# EAGLE design 510_health_arduino (EAGLE 9.6.2)
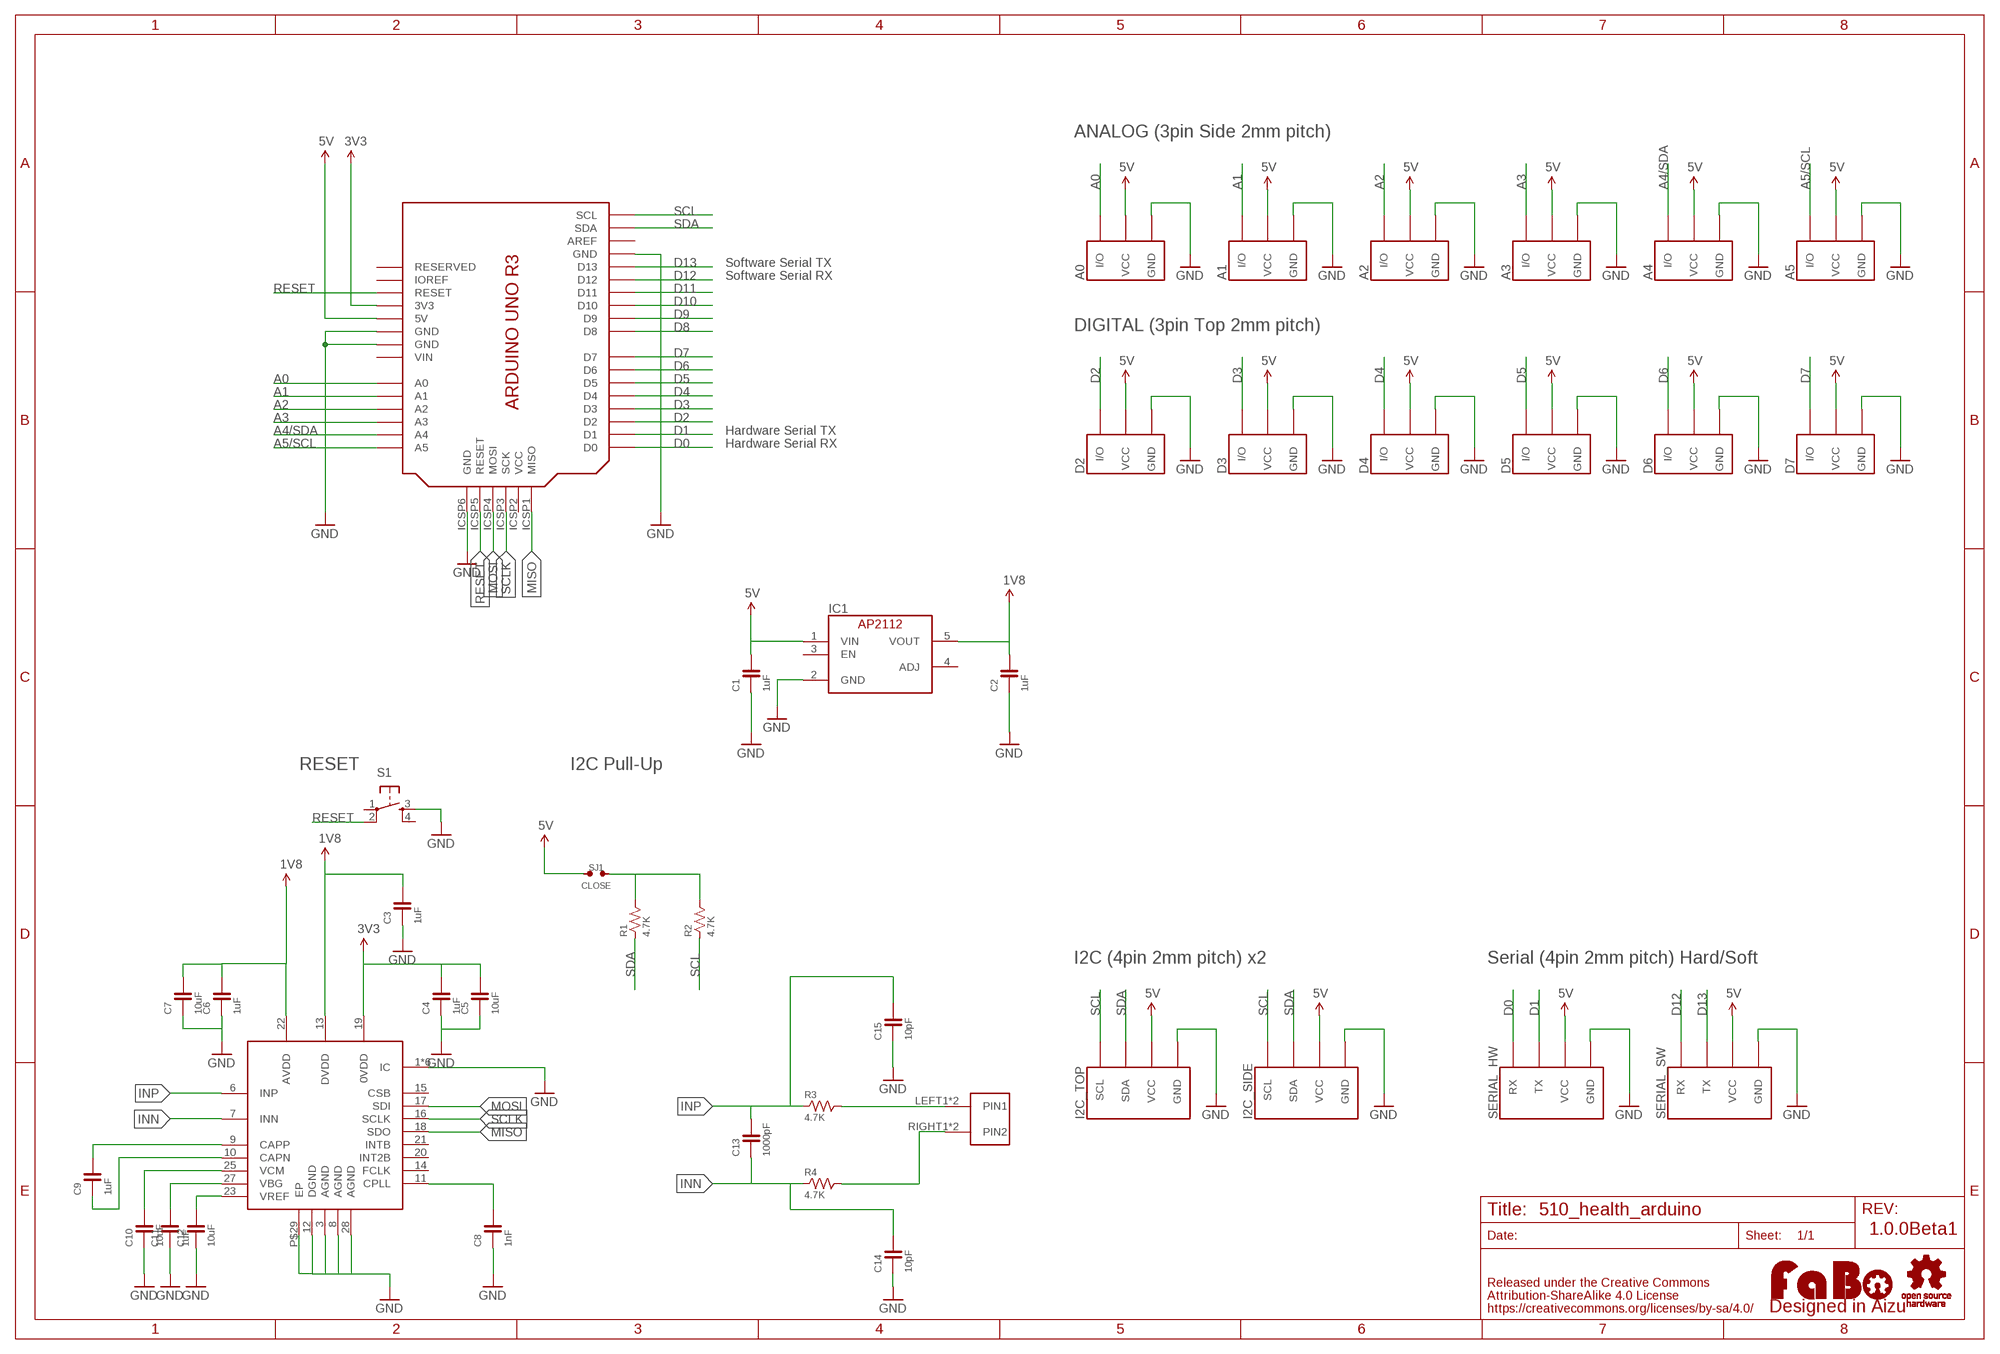
[diagram p0: schematic, sheet 1]

## Parts
A0  FABO_BRICK_3PIN-S03B-PASK-2_LONG  [FABO_BRICK_3PIN_S03B-PASK-2_LONG]
A1  FABO_BRICK_3PIN-S03B-PASK-2_LONG  [FABO_BRICK_3PIN_S03B-PASK-2_LONG]
A2  FABO_BRICK_3PIN-S03B-PASK-2_LONG  [FABO_BRICK_3PIN_S03B-PASK-2_LONG]
A3  FABO_BRICK_3PIN-S03B-PASK-2_LONG  [FABO_BRICK_3PIN_S03B-PASK-2_LONG]
A4  FABO_BRICK_3PIN-S03B-PASK-2_LONG  [FABO_BRICK_3PIN_S03B-PASK-2_LONG]
A5  FABO_BRICK_3PIN-S03B-PASK-2_LONG  [FABO_BRICK_3PIN_S03B-PASK-2_LONG]
C1  1uF  CAPACITOR-0603  [0603]
C2  1uF  CAPACITOR-0603  [0603]
C3  1uF  CAPACITOR-0603  [0603]
C4  1uF  CAPACITOR-0603  [0603]
C5  10uF  CAPACITOR-0603  [0603]
C6  1uF  CAPACITOR-0603  [0603]
C7  10uF  CAPACITOR-0603  [0603]
C8  1nF  CAPACITOR-0603  [0603]
C9  1uF  CAPACITOR-0603  [0603]
C10  10uF  CAPACITOR-0603  [0603]
C11  1uF  CAPACITOR-0603  [0603]
C12  10uF  CAPACITOR-0603  [0603]
C13  1000pF  CAPACITOR-0603  [0603]
C14  10pF  CAPACITOR-0603  [0603]
C15  10pF  CAPACITOR-0603  [0603]
D2  FABO_BRICK_3PIN-B03B-PASK-1  [FABO_BRICK_3PIN_B03B-PASK-1]
D3  FABO_BRICK_3PIN-B03B-PASK-1  [FABO_BRICK_3PIN_B03B-PASK-1]
D4  FABO_BRICK_3PIN-B03B-PASK-1  [FABO_BRICK_3PIN_B03B-PASK-1]
D5  FABO_BRICK_3PIN-B03B-PASK-1  [FABO_BRICK_3PIN_B03B-PASK-1]
D6  FABO_BRICK_3PIN-B03B-PASK-1  [FABO_BRICK_3PIN_B03B-PASK-1]
D7  FABO_BRICK_3PIN-B03B-PASK-1  [FABO_BRICK_3PIN_B03B-PASK-1]
E1  MA-MAX30003  [MAXIM-MAX30003]
I2C_SIDE  FABO_BRICK_I2C-S04B-PASK-2_LONG  [FABO_BRICK_I2C_S04B-PASK-2_LONG]
I2C_TOP  FABO_BRICK_I2C-B04B-PASK-1  [FABO_BRICK_I2C_B04B-PASK-1]
IC1  AP2112K-1.8TRG1  [SOT-23-5]
LOGO1  LOGO_FABO-M  [LOGO_FABO_M]
R1  4.7K  RESISTOR-0603  [0603]
R2  4.7K  RESISTOR-0603  [0603]
R3  4.7K  RESISTOR-0603  [0603]
R4  4.7K  RESISTOR-0603  [0603]
S1  TACT-SWITCH-6MM  [DTS_6_V]
SERIAL_HW  FABO_BRICK_SERIAL-B04B-PASK-1  [FABO_BRICK_SERIAL_B04B-PASK-1]
SERIAL_SW  FABO_BRICK_SERIAL-B04B-PASK-1  [FABO_BRICK_SERIAL_B04B-PASK-1]
SJ1  CLOSE  SMD-JUMPER-2-0603  [SMD-JUMPER-0603]
U$4  ML-1400-S1  [ML-1400-S1]
U$13  LOGO_OSHW-T_M_BOTTOM  [LOGO_OSHW_T_MS_BOTTOM]
U$15  ARDUINO_UNO_R3_SPI  [ARDUINO_UNO_R3_SPI]

## Nets
1V8: C2.2 C3.2 C6.2 C7.2 E1.13(DVDD) E1.22(AVDD) IC1.5(VOUT)
3V3: C4.2 C5.2 E1.19(0VDD) U$15.3V3
5V: A0.VCC A1.VCC A2.VCC A3.VCC A4.VCC A5.VCC C1.2 D2.VCC D3.VCC D4.VCC D5.VCC D6.VCC D7.VCC I2C_SIDE.VCC I2C_TOP.VCC IC1.1(VIN) SERIAL_HW.VCC SERIAL_SW.VCC SJ1.1 U$15.5V
A0: A0.I/O U$15.A0
A1: A1.I/O U$15.A1
A2: A2.I/O U$15.A2
A3: A3.I/O U$15.A3
A4/SDA: A4.I/O U$15.A4
A5/SCL: A5.I/O U$15.A5
D0: SERIAL_HW.RX U$15.D0
D1: SERIAL_HW.TX U$15.D1
D2: D2.I/O U$15.D2
D3: D3.I/O U$15.D3
D4: D4.I/O U$15.D4
D5: D5.I/O U$15.D5
D6: D6.I/O U$15.D6
D7: D7.I/O U$15.D7
D8: U$15.D8
D9: U$15.D9
D10: U$15.D10
D11: U$15.D11
D12: SERIAL_SW.RX U$15.D12
D13: SERIAL_SW.TX U$15.D13
GND: A0.GND A1.GND A2.GND A3.GND A4.GND A5.GND C1.1 C2.1 C3.1 C4.1 C5.1 C6.1 C7.1 C8.1 C10.1 C11.1 C12.1 C14.1 C15.1 D2.GND D3.GND D4.GND D5.GND D6.GND D7.GND E1.1(IC) E1.2(IC) E1.3(AGND) E1.4(IC) E1.5(IC) E1.8(AGND) E1.12(DGND) E1.24(IC) E1.26(IC) E1.28(AGND) E1.P$29(EP) I2C_SIDE.GND I2C_TOP.GND IC1.2(GND) S1.3 SERIAL_HW.GND SERIAL_SW.GND U$15.GND1(GND) U$15.GND2(GND) U$15.GND3(GND) U$15.ICSP6(GND)
INN: C13.1 C14.2 E1.7(INN) R4.1
INP: C13.2 C15.2 E1.6(INP) R3.1
MISO: E1.18(SDO) U$15.ICSP1(MISO)
MOSI: E1.17(SDI) U$15.ICSP4(MOSI)
N$1: R1.2 R2.2 SJ1.2
N$2: C9.2 E1.9(CAPP)
N$3: C9.1 E1.10(CAPN)
N$4: C8.2 E1.11(CPLL)
N$5: R3.2 U$4.LEFT1(PIN1) U$4.LEFT2(PIN1)
N$6: R4.2 U$4.RIGHT1(PIN2) U$4.RIGHT2(PIN2)
N$7: C10.2 E1.25(VCM)
N$8: C11.2 E1.27(VBG)
N$9: C12.2 E1.23(VREF)
RESET: S1.2 U$15.ICSP5(RESET) U$15.RESET
SCL: I2C_SIDE.SCL I2C_TOP.SCL R2.1 U$15.SCL
SCLK: E1.16(SCLK) U$15.ICSP3(SCK)
SDA: I2C_SIDE.SDA I2C_TOP.SDA R1.1 U$15.SDA
Unconnected: E1.14(FCLK) E1.15(CSB) E1.20(INT2B) E1.21(INTB) IC1.3(EN) IC1.4(ADJ) S1.1 S1.4 U$15.AREF U$15.ICSP2(VCC) U$15.IOREF U$15.RESERVED

## Notes on the sheet
- ANALOG (3pin Side 2mm pitch)
- Software Serial TX
- Software Serial RX
- DIGITAL (3pin Top 2mm pitch)
- Hardware Serial TX
- Hardware Serial RX
- RESET | I2C Pull-Up
- I2C (4pin 2mm pitch) x2 | Serial (4pin 2mm pitch) Hard/Soft
- 1.0.0Beta1

## Power pins joined to a net without a drawn wire
VIN: U$15.VIN

## Library data of the parts
A0 A1-A5 D2-D7 = FaBo-Template:FABO_BRICK_3PIN: FaBo Brick 3pin
C1-C15 = FaBo-Capacitor:CAPACITOR: CAPACITOR
E1 = FaBo-Mems:MA-MAX30003
I2C_SIDE I2C_TOP = FaBo-Template:FABO_BRICK_I2C: FaBo Brick I2C
IC1 = FaBo-Supply:AP2112
LOGO1 = component:LOGO_FABO
R1-R4 = FaBo-Resistors:RESISTOR: RESISTOR
S1 = FaBo-Switch:TACT-SWITCH
SERIAL_HW SERIAL_SW = FaBo-Template:FABO_BRICK_SERIAL: FaBo Brick Serial
SJ1 = FaBo-Supply:SMD-JUMPER-2
U$4 = FaBo-Terminal:ML-1400-S1
U$13 = FaBo-etc:LOGO_OSHW
U$15 = FaBo-Boards:ARDUINO_UNO_R3_SPI

## Board
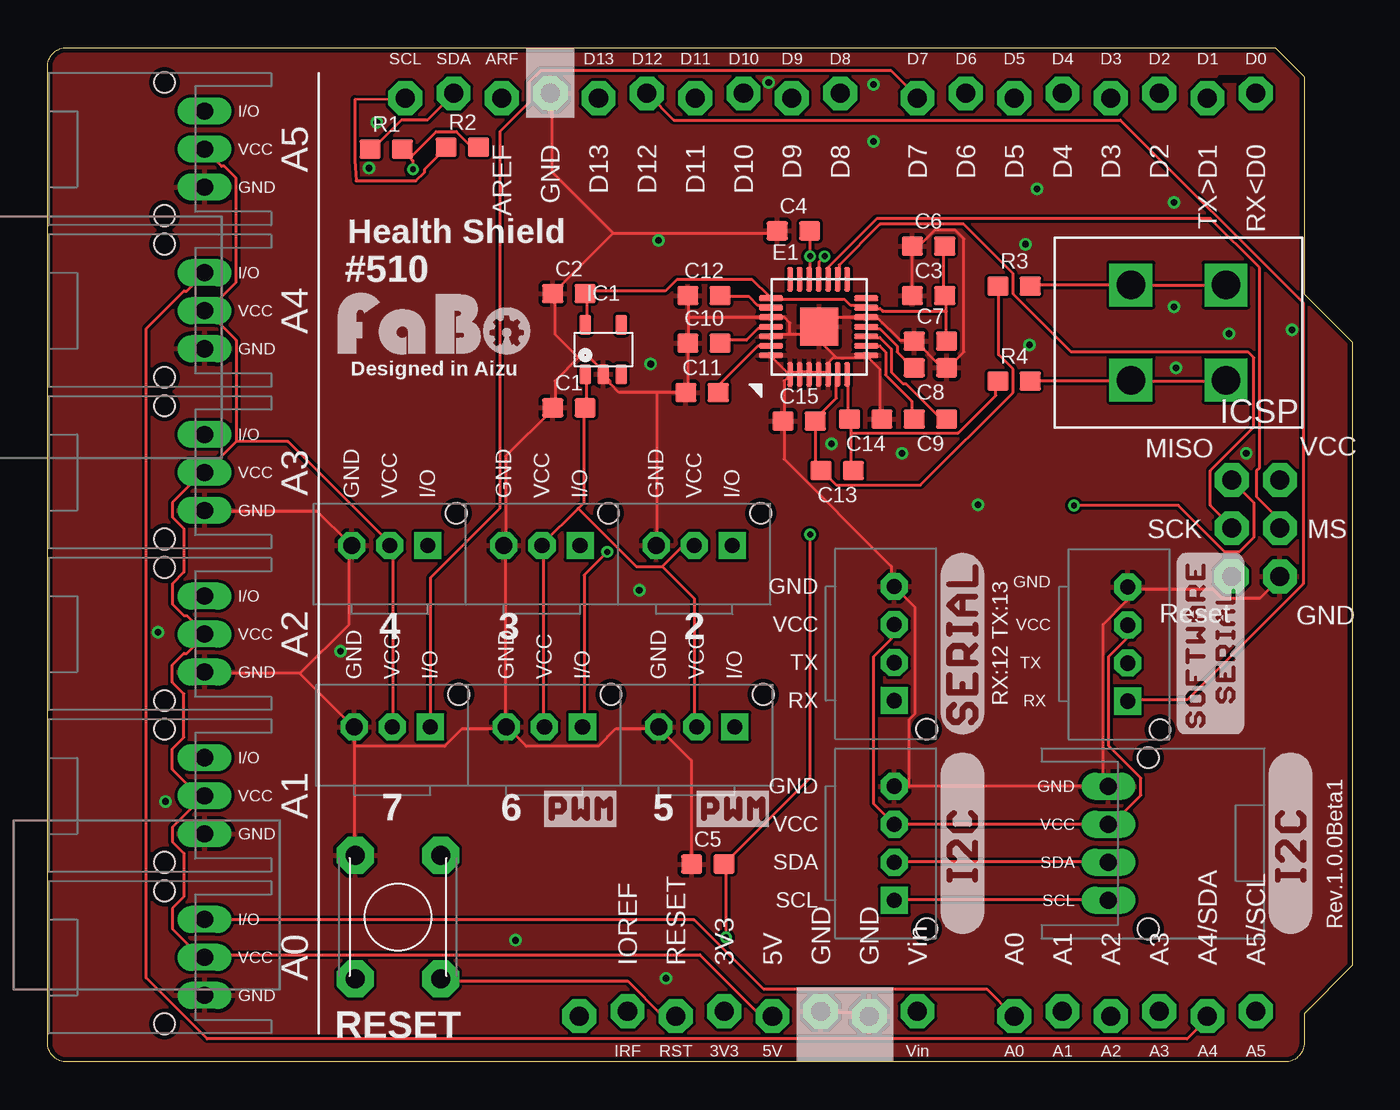
[diagram p1: board, top side]
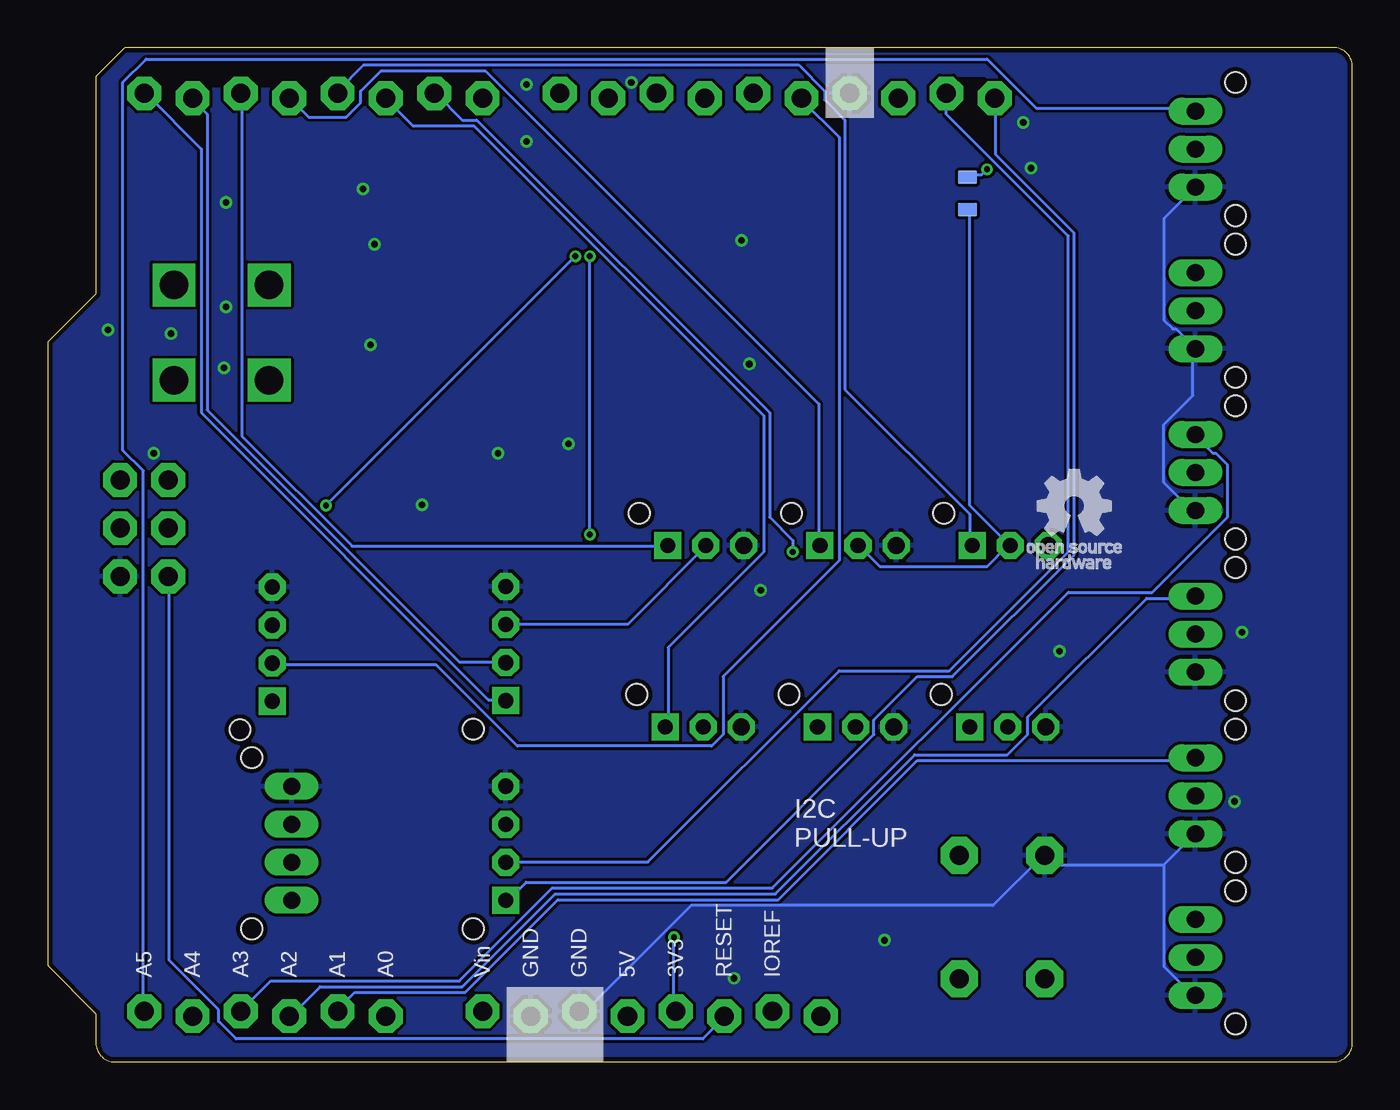
[diagram p2: board, bottom side, seen from below]

Size 68.58 x 53.34 mm. Coordinates in mm from the lower left corner, seen from the top.
Copper layers (1*16): Top 0.035mm / dielectric 1.6mm / Bottom 0.035mm
Design rules "PCBway": minimum track width 6mil, minimum drill 12mil, track to track 6mil, track to pad 6mil, pad to pad 6mil, via to via 6mil, smd to smd 6mil, copper to edge 10mil, drill to drill 10mil, minimum pad ring 10mil, minimum via ring 6mil, stop-mask expansion 2mil, vias tented up to drill 100mil, thermal gap 8mil
tRestrict: area 61.3,51.6 to 63,51.8; area 43.7,19.8 to 43.8,20.6
bRestrict: area 51.8,2 to 52.5,2.2; area 54.1,2 to 54.9,2.2; area 19.3,51.6 to 20.7,51.7; area 54,51.3 to 60.5,51.7

### Footprints (pad centres in the part's own frame; a part is rotated, then mirrored left to right if it is on the bottom)
FABO_BRICK_3PIN_S03B-PASK-2_LONG = drill 0.9 pad 1.422 long: GND -2,0; I/O 2,0; VCC 0,0 | hole 1.1: 3.5,2.1; -3.5,2.1
0603 = smd 1.1 x 1: 1 -0.85,0; 2 0.85,0
FABO_BRICK_3PIN_B03B-PASK-1 = drill 0.9 pad 1.422 octagon: GND -2,0 | drill 0.8 pad 1.422 square: I/O 2,0 | drill 0.8 pad 1.422 octagon: VCC 0,0 | hole 1.1: 3.5,1.7
MAXIM-MAX30003 = smd 0.3 x 1.27: 1 -1.54,-2.5; 2 -1.04,-2.5; 3 -0.54,-2.5; 4 -0.04,-2.5; 5 0.46,-2.5; 6 0.96,-2.5; 7 1.46,-2.5; 15 1.46,2.5; 16 0.96,2.5; 17 0.46,2.5; 18 -0.04,2.5; 19 -0.54,2.5; 20 -1.04,2.5; 21 -1.54,2.5 | smd 1.27 x 0.3: 8 2.46,-1.5; 9 2.46,-1; 10 2.46,-0.5; 11 2.46,0; 12 2.46,0.5; 13 2.46,1; 14 2.46,1.5; 22 -2.54,1.5; 23 -2.54,1; 24 -2.54,0.5; 25 -2.54,0; 26 -2.54,-0.5; 27 -2.54,-1; 28 -2.54,-1.5 | smd 2 x 2: P$29 0,0
FABO_BRICK_I2C_S04B-PASK-2_LONG = drill 0.9 pad 1.422 long: GND -3,0; SCL 3,0; SDA 1,0; VCC -1,0 | hole 1.1: 4.5,2.1; -4.5,2.1
FABO_BRICK_I2C_B04B-PASK-1 = drill 0.8 pad 1.422 octagon: GND -3,0; SDA 1,0; VCC -1,0 | drill 0.8 pad 1.422 square: SCL 3,0 | hole 1.1: 4.5,1.7
SOT-23-5 = smd 0.6 x 1.05: 1 -0.95,-1.3; 2 0,-1.3; 3 0.95,-1.3; 4 0.95,1.3; 5 -0.95,1.3
DTS_6_V = drill 1 pad 1.93 octagon: 1 -3.25,2.25; 2 3.25,2.25; 3 -3.25,-2.25; 4 3.25,-2.25
FABO_BRICK_SERIAL_B04B-PASK-1 = drill 0.8 pad 1.422 octagon: GND -3,0; TX 1,0; VCC -1,0 | drill 0.8 pad 1.422 square: RX 3,0 | hole 1.1: 4.5,1.7
SMD-JUMPER-0603 = smd 0.71 x 1: 1 -0.85,0; 2 0.85,0
ML-1400-S1 = drill 1.5 square: LEFT1 -2.5,2.5; LEFT2 -2.5,-2.5; RIGHT1 2.5,2.5; RIGHT2 2.5,-2.5
ARDUINO_UNO_R3_SPI = drill 1 pad 1.778 octagon: 3V3 35.56,2.667; 5V 38.1,2.413; A0 50.8,2.413; A1 53.34,2.667; A2 55.88,2.413; A3 58.42,2.667; A4 60.96,2.413; A5 63.5,2.667; AREF 23.876,50.673; D0 63.5,50.927; D1 60.96,50.673; D2 58.42,50.927; D3 55.88,50.673; D4 53.34,50.927; D5 50.8,50.673; D6 48.26,50.927; D7 45.72,50.673; D8 41.656,50.927; D9 39.116,50.673; D10 36.576,50.927; D11 34.036,50.673; D12 31.496,50.927; D13 28.956,50.673; GND1 43.18,2.413; GND2 40.64,2.667; GND3 26.416,50.927; ICSP1 62.23,30.607; ICSP2 64.77,30.607; ICSP3 62.23,28.067; ICSP4 64.77,28.067; ICSP5 62.23,25.527; ICSP6 64.77,25.527; IOREF 30.48,2.667; RESERVED 27.94,2.413; RESET 33.02,2.413; SCL 18.796,50.673; SDA 21.336,50.927; VIN 45.72,2.667

### Placement (x,y rotation side)
A0  8.25,5.5 90 top
A1  8.25,14 90 top
A2  8.25,22.5 90 top
A3  8.25,31 90 top
A4  8.25,39.5 90 top
A5  8.25,48 90 top
C1  27.4,34.4 0 top
C2  27.4,40.4 0 top
C3  46.3,40.3 0 top
C4  39.2,43.7 0 top
C5  34.7,10.4 0 top
C6  46.3,42.9 0 top
C7  46.4,37.9 0 top
C8  46.4,36.5 180 top
C9  46.4,33.8 180 top
C10  34.5,37.8 0 top
C11  34.4,35.2 0 top
C12  34.5,40.3 0 top
C13  41.5,31.1 180 top
C14  43,33.8 180 top
C15  39.5,33.7 0 top
D2  33.98,27.15 0 top
D3  25.98,27.15 0 top
D4  17.98,27.15 0 top
D5  34.12,17.62 0 top
D6  26.11,17.62 0 top
D7  18.11,17.62 0 top
E1  40.56,38.66 0 top
I2C_SIDE  55.75,11.5 270 top
I2C_TOP  44.5,11.5 270 top
IC1  29.21,37.47 0 top
LOGO1  20.32,36.83 0 top
R1  17.8,48 0 top
R2  21.8,48.1 0 top
R3  50.8,40.8 0 top
R4  50.8,35.8 0 top
S1  18.41,7.62 270 top
SERIAL_HW  44.5,22 270 top
SERIAL_SW  56.77,21.97 270 top
SJ1  20.23,45.67 90 bottom
U$2  [LOGO_SILK_SERIAL2]  49.25,22 90 top
U$3  [LOGO_SILK_SERIAL]  62.92,22 90 top
U$4  59.44,38.35 270 top
U$5  [LOGO_SILK_PWM]  34.12,12.38 0 top
U$6  [LOGO_SILK_PWM]  26.11,12.38 0 top
U$11  [LOGO_SILK_I2C]  66.5,11.5 90 top
U$12  [LOGO_SILK_I2C]  49.25,11.5 90 top
U$13  14.61,29.21 0 top
U$15  0,0 0 top

### Tracks (layer width: path | path; a pad name or v marks a point on that pad's centre or on a via)
1V8
  Top 0.152: 47.24,39.47 47.24,37.95 C7.2 | 47.24,39.47 47.24,40.23 C3.2 47.09,40.39 47.09,42.82 C6.2 | IC1.5 28.35,38.86 28.35,40.39 C2.2 28.35,40.54 32.46,40.54 33.07,41.15 37.03,41.15 37.95,40.23 E1.22 38.1,40.08 41.91,40.08 42.22,39.78 42.98,39.78 E1.13 43.13,39.62 43.74,39.62 43.89,39.47 47.24,39.47
3V3  (via drill 0.3)
  Top 0.152: C4.2 40.08,43.59 v40.08,42.37 40.08,41.3 E1.19 | v35.66,6.55 35.66,10.36 C5.2 35.66,10.52 40.08,14.94 v40.08,27.74
  Bottom 0.152: v35.66,6.55 35.66,2.74 U$15.3V3 | v40.08,27.74 v40.08,42.37
5V
  Top 0.152: 8.08,13.87 8.23,14.02 A1.VCC 8.08,13.87 | 8.08,13.87 6.55,12.34 6.55,11.58 7.16,10.97 7.16,8.69 6.55,8.08 6.55,7.01 7.92,5.64 8.23,5.64 A0.VCC 8.38,5.64 34.29,5.64 37.49,2.44 38.1,2.44 U$15.5V | 8.08,13.87 6.55,15.39 6.55,16.46 7.16,17.07 7.16,19.36 6.55,19.96 6.55,20.88 7.16,21.49 7.32,21.49 8.23,22.4 A2.VCC 8.23,22.55 7.32,23.47 7.16,23.47 6.55,24.08 6.55,25.15 7.16,25.76 7.16,28.04 6.55,28.65 6.55,29.41 8.23,31.09 A3.VCC 8.38,31.09 9.91,32.61 | 9.91,32.61 9.91,37.95 8.38,39.47 | 8.38,39.47 9.91,41 9.91,46.48 9.3,47.09 9.14,47.09 8.38,47.85 A5.VCC | 8.38,39.47 A4.VCC | D7.VCC 18.14,17.68 18.14,27.13 D4.VCC 17.98,27.28 12.65,32.61 9.91,32.61 | SERIAL_HW.VCC 44.35,22.86 44.35,22.25 43.43,21.34 43.43,13.56 44.35,12.65 I2C_TOP.VCC 55.63,12.5 I2C_SIDE.VCC 55.78,12.65 56.08,12.65 57.45,14.02 57.45,14.94 55.78,16.61 55.78,21.34 56.69,22.25 56.69,22.86 SERIAL_SW.VCC | IC1.1 28.35,36.12 28.35,34.44 C1.2 28.19,34.29 28.19,29.41 27.89,29.11 | 27.89,29.11 26.06,27.28 D3.VCC 26.06,27.13 26.06,17.68 D6.VCC | 32.31,26.06 33.38,27.13 33.83,27.13 D2.VCC | 32.31,26.06 30.94,26.06 27.89,29.11 | 32.31,26.06 33.98,24.38 33.98,17.68 D5.VCC
  Bottom 0.152: SJ1.1 20.12,44.81 20.12,29.26 18.14,27.28 D4.VCC 18.14,27.13 19.2,26.06 24.84,26.06 25.91,27.13 D3.VCC | SERIAL_HW.VCC 44.35,23.01 38.1,23.01 33.98,27.13 D2.VCC
A0
  Top 0.152: A0.I/O 8.38,7.47 33.98,7.47 37.64,3.81 49.38,3.81 50.75,2.44 U$15.A0
A1
  Bottom 0.152: A1.I/O 8.38,15.85 22.86,15.85 30.18,8.53 41.76,8.53 46.63,3.66 52.43,3.66 53.34,2.74 U$15.A1
A2
  Bottom 0.152: A2.I/O 8.38,24.38 10.82,24.38 17.07,18.14 17.07,17.22 18.14,16.15 23.01,16.15 30.33,8.84 41.91,8.84 46.79,3.96 54.25,3.96 55.78,2.44 U$15.A2
A3
  Bottom 0.152: A3.I/O 8.23,32.92 7.32,32 7.16,32 6.55,31.39 6.55,28.65 10.52,24.69 14.94,24.69 30.48,9.14 42.06,9.14 46.94,4.27 56.84,4.27 58.37,2.74 U$15.A3
A4/SDA
  Top 0.152: A4.I/O 8.23,41.45 7.32,40.54 7.16,40.54 5.18,38.56 5.18,4.42 8.38,1.22 59.89,1.22 60.96,2.29 U$15.A4
A5/SCL
  Bottom 0.152: A5.I/O 8.38,50.14 16.61,50.14 19.2,52.73 63.4,52.73 64.62,51.51 64.62,32.16 63.55,31.09 63.55,2.74 U$15.A5
D0
  Bottom 0.152: SERIAL_HW.RX 44.5,19.05 45.41,19.05 60.5,34.14 60.5,48.01 63.4,50.9 U$15.D0
D1
  Bottom 0.152: SERIAL_HW.TX 44.5,21.03 46.94,21.03 60.2,34.29 60.2,49.84 60.96,50.6 U$15.D1
D2
  Bottom 0.152: D2.I/O 36.12,27.13 52.58,27.13 58.37,32.92 58.37,50.9 U$15.D2
D3
  Bottom 0.152: D3.I/O 28.04,27.28 28.04,34.59 45.57,52.12 51.05,52.12 52.12,51.05 52.12,50.44 52.88,49.68 54.86,49.68 55.78,50.6 U$15.D3
D4
  Bottom 0.152: D4.I/O 20.12,27.28 20.12,28.8 26.67,35.36 26.67,49.53 27.74,50.6 27.74,51.05 29.11,52.43 51.97,52.43 53.34,51.05 U$15.D4
D5
  Bottom 0.152: D5.I/O 35.97,17.68 35.97,21.79 30.94,26.82 30.94,33.98 46.18,49.23 49.38,49.23 50.75,50.6 U$15.D5
D6  (via drill 0.3)
  Top 0.152: v29.41,26.82 28.19,25.6 28.19,17.68 D6.I/O
  Bottom 0.152: v29.41,26.82 29.41,27.43 30.63,28.65 30.63,34.14 46.02,49.53 46.79,49.53 48.16,50.9 U$15.D6
D7
  Top 0.152: D7.I/O 20.12,17.68 20.12,25.45 23.77,29.11 23.77,48.92 25.3,50.44 25.3,51.51 25.91,52.12 44.35,52.12 45.72,50.75 U$15.D7
D12
  Top 0.152: SERIAL_SW.RX 56.84,19.05 59.89,19.05 65.99,25.15 65.99,39.93 56.39,49.53 32.92,49.53 31.55,50.9 U$15.D12
D13
  Bottom 0.152: SERIAL_SW.TX 56.69,20.88 48.16,20.88 43.89,16.61 33.68,16.61 33.07,17.22 33.07,20.27 26.98,26.36 26.98,48.62 28.96,50.6 U$15.D13
GND  (via drill 0.35)
  Top 0.152: U$15.ICSP6 64.77,25.45 63.7,24.38 61.72,24.38 61.27,24.84 56.84,24.84 SERIAL_SW.GND 56.69,24.84 56.69,24.23 55.47,23.01 55.47,14.48 | 55.47,14.48 55.63,14.48 I2C_SIDE.GND 55.47,14.48 | 55.47,14.48 45.26,14.48 | 45.26,14.48 44.5,14.48 I2C_TOP.GND | C3.1 45.41,40.39 45.41,42.82 C6.1 45.57,42.98 45.87,42.98 46.63,43.74 47.7,43.74 48.16,43.28 48.16,37.34 47.4,36.58 C8.1 47.24,36.58 46.94,36.58 45.57,37.95 C7.1 45.41,37.95 44.81,37.95 43.59,39.17 43.13,39.17 E1.12 42.98,39.17 41.15,39.17 40.69,38.71 E1.P$29 | 40.23,38.25 39.01,38.25 | 39.01,38.25 38.1,38.25 E1.26 | 40.23,38.25 40.54,38.56 E1.P$29 | 39.01,38.25 39.01,38.86 38.71,39.17 38.1,39.17 E1.24 37.95,39.17 33.68,39.17 | C14.1 43.74,33.83 43.74,36.42 43.13,37.03 E1.8 42.98,37.03 41.45,37.03 | 41,36.27 40.54,36.27 E1.4 40.39,36.27 40.08,36.27 E1.3 39.93,36.27 39.62,36.27 E1.2 39.47,36.27 39.17,36.27 E1.1 39.01,36.12 | 39.01,36.12 38.71,35.81 38.71,33.83 C15.1 38.71,33.68 38.71,31.7 44.35,26.06 44.35,25.15 SERIAL_HW.GND 45.57,23.93 45.57,18.29 45.26,17.98 45.26,14.48 | 39.01,36.12 38.1,37.03 E1.28 | 41.45,37.03 41.3,37.03 41,36.73 41,36.27 | 41,36.27 E1.5 | 41.45,37.03 40.23,38.25 | 40.23,38.25 E1.P$29 | 33.68,39.17 33.68,40.23 C12.1 | 33.68,39.17 33.68,37.95 C10.1 33.68,37.8 33.68,35.2 C11.1 33.53,35.2 32,35.2 | 32,35.2 30.02,35.2 29.57,35.66 29.57,35.81 29.26,36.12 IC1.2 29.26,36.27 28.5,37.03 27.89,37.03 | 27.89,37.03 26.67,35.81 26.67,34.44 C1.1 26.52,34.29 24.08,31.85 24.08,27.28 D3.GND 24.08,27.13 24.08,17.68 D6.GND | 27.89,37.03 26.67,38.25 26.67,40.39 C2.1 26.67,40.54 29.72,43.59 | 29.72,43.59 38.25,43.59 C4.1
  Top 0.152: 32,35.2 32,27.28 D2.GND | 29.72,43.59 26.52,46.79 26.52,50.9 U$15.GND3 | C5.1 33.83,10.52 33.83,15.85 32.16,17.53 D5.GND 32,17.53 29.87,17.53 28.96,16.61 25.15,16.61 24.23,17.53 D6.GND | U$15.GND2 40.69,2.59 42.98,2.59 43.13,2.44 U$15.GND1 | 16.15,16.61 16.15,10.97 S1.3 | 16.15,16.61 16.15,17.53 D7.GND 16,17.68 13.26,20.42 | 13.26,20.42 8.38,20.42 A2.GND | 13.26,20.42 15.85,23.01 15.85,27.13 D4.GND 15.85,27.28 14.17,28.96 8.38,28.96 A3.GND | 16.15,16.61 20.88,16.61 21.79,17.53 24.08,17.53 D6.GND
  Bottom 0.152: A5.GND 8.38,45.87 9.91,44.35 9.91,39.01 9.45,38.56 9.3,38.56 8.38,37.64 A4.GND 8.38,37.49 8.38,35.05 9.91,33.53 9.91,30.48 8.38,28.96 A3.GND | 9.91,10.36 9.91,5.03 8.38,3.5 A0.GND | 9.91,10.36 8.38,11.89 A1.GND | U$15.GND2 40.54,2.74 40.23,2.74 34.75,8.23 18.9,8.23 16.31,10.82 S1.3 16.15,10.82 15.7,10.36 9.91,10.36
  other vias: 51.4,43 52,45.9 59.2,45.2 59.2,39.7 62.1,38.3 51.6,37.7 44.9,32 48.9,29.3 31.7,36.7 32.1,43.2 43.4,51.4 43.4,48.4 31.1,24.8 15.4,21.6 24.6,6.4 32.5,4.4 6.2,13.7 5.8,22.6 65.4,38.5 59.3,36.5 41.2,32.5 16.9,47 17.3,49.4 37.9,51.5 63,32
  pour Bottom: 0,0 0,53.34 68.58,53.34 68.58,0
  pour Top: 0,0 0,53.34 68.58,53.34 68.58,0
INN
  Top 0.152: E1.7 42.06,36.12 42.06,33.83 C14.2 42.22,33.68 42.22,33.07 | 42.22,33.07 42.22,31.24 C13.1 | 42.22,33.07 47.85,33.07 49.84,35.05 49.84,35.66 R4.1
INP
  Top 0.152: R3.1 49.99,40.69 49.99,37.19 50.75,36.42 50.75,35.2 45.87,30.33 41.45,30.33 40.69,31.09 C13.2 40.54,31.24 40.39,31.39 40.39,33.68 C15.2 40.39,33.83 41.45,34.9 41.45,36.12 E1.6
MISO  (via drill 0.3)
  Top 0.152: v40.84,42.37 40.54,42.06 40.54,41.3 E1.18 | v53.95,29.26 59.44,29.26 61.87,26.82 62.64,26.82 63.4,27.58 63.4,29.41 62.33,30.48 U$15.ICSP1
  Bottom 0.152: v53.95,29.26 v40.84,42.37
MOSI
  Top 0.152: U$15.ICSP4 64.77,28.5 63.55,29.72 63.55,31.09 63.7,31.24 63.7,41.76 61.11,44.35 43.59,44.35 41,41.76 41,41.3 E1.17
N$1  (via drill 0.3)
  Top 0.152: v19.2,46.94 19.2,47.4 19.05,47.55 | 19.05,47.55 18.75,47.85 R1.2 19.05,47.55 | 19.05,47.55 20.42,48.92 21.49,48.92 22.25,48.16 22.55,48.16 R2.2
  Bottom 0.152: v19.2,46.94 19.51,46.63 20.12,46.63 SJ1.2
N$2
  Top 0.152: C9.2 45.41,33.83 45.41,34.75 44.04,36.12 44.04,37.34 43.74,37.64 43.13,37.64 E1.9
N$3
  Top 0.152: C9.1 47.24,33.83 46.94,33.83 45.11,35.66 44.96,35.66 44.35,36.27 44.35,37.49 43.74,38.1 43.13,38.1 E1.10
N$4
  Top 0.152: C8.2 45.41,36.58 44.65,37.34 44.65,37.64 43.74,38.56 43.13,38.56 E1.11
N$5
  Top 0.152: R3.2 51.66,40.84 56.84,40.84 U$4.LEFT2 57,40.84 61.87,40.84 U$4.LEFT1
N$6
  Top 0.152: R4.2 51.66,35.81 56.84,35.81 U$4.RIGHT2 57,35.81 61.87,35.81 U$4.RIGHT1
N$7
  Top 0.152: C10.2 35.36,37.95 36.73,37.95 37.34,38.56 37.95,38.56 E1.25
N$8
  Top 0.152: C11.2 35.36,35.2 35.36,35.66 37.34,37.64 37.95,37.64 E1.27
N$9
  Top 0.152: C12.2 35.36,40.23 36.88,40.23 37.34,39.78 37.95,39.78 E1.23
RESET
  Top 0.152: U$15.RESET 32.92,2.44 32.31,2.44 30.48,4.27 20.73,4.27 S1.2
  Bottom 0.152: U$15.ICSP5 62.18,25.45 62.18,5.33 59.59,2.74 59.59,2.13 58.67,1.22 34.14,1.22 33.07,2.29 U$15.RESET
SCL
  Top 0.152: R2.1 20.88,48.01 19.81,46.94 19.81,46.79 19.36,46.33 16.22,46.33 16.15,47.4 16.15,50.62 18.14,50.6 18.75,50.6 U$15.SCL | I2C_TOP.SCL 44.5,8.53 55.63,8.53 I2C_SIDE.SCL
  Bottom 0.152: U$15.SCL 18.75,50.6 18.75,47.7 14.63,43.59 14.63,26.67 21.03,20.27 22.86,20.27 25.15,17.98 25.15,17.22 32.92,9.45 43.43,9.45 44.35,8.53 I2C_TOP.SCL
SCLK
  Top 0.152: E1.16 41.6,41.3 41.6,41.91 43.74,44.04 48.16,44.04 50.75,41.45 50.75,40.39 53.8,37.34 63.09,37.34 63.4,37.03 63.4,33.38 61.11,31.09 61.11,29.26 62.18,28.19 U$15.ICSP3
SDA
  Top 0.152: R1.1 17.07,48.01 18.59,49.53 19.96,49.53 21.34,50.9 U$15.SDA | I2C_TOP.SDA 44.5,10.52 55.63,10.52 I2C_SIDE.SDA
  Bottom 0.152: U$15.SDA 21.34,49.84 14.94,43.43 14.94,26.82 21.18,20.57 26.98,20.57 37.03,10.52 44.35,10.52 I2C_TOP.SDA

### Text on the board
tPlace: SCL | SDA | ARF | D13 | D12 | D11 | D10 | D9 | D8 | D7 | D6 | D5 | D4 | D3 | D2 | D1 | D0 | I/O | VCC | GND | Health Shield | I/O | #510 | VCC | GND | Designed in Aizu | I/O | VCC | GND | VCC | I/O | GND | VCC | I/O | GND | VCC | I/O | GND | GND | GND | I/O | 4 | 3 | 2 | VCC | VCC | VCC | RX:12 TX:13 | TX | TX | GND | GND | VCC | I/O | GND | VCC | I/O | GND | VCC | I/O | RX | RX | I/O | VCC | 7 | 6 | 5 | GND | GND | GND | VCC | VCC | SDA | SDA | I/O | SCL | SCL | Rev.1.0.0Beta1 | VCC | GND | RESET | IRF | RST | 3V3 | 5V | Vin | A0 | A1 | A2 | A3 | A4 | A5
bPlace: I2C / PULL-UP | IOREF | RESET | 3V3 | 5V | GND | GND | Vin | A0 | A1 | A2 | A3 | A4 | A5